# Altium project Sub Board Bottom.PrjPcb
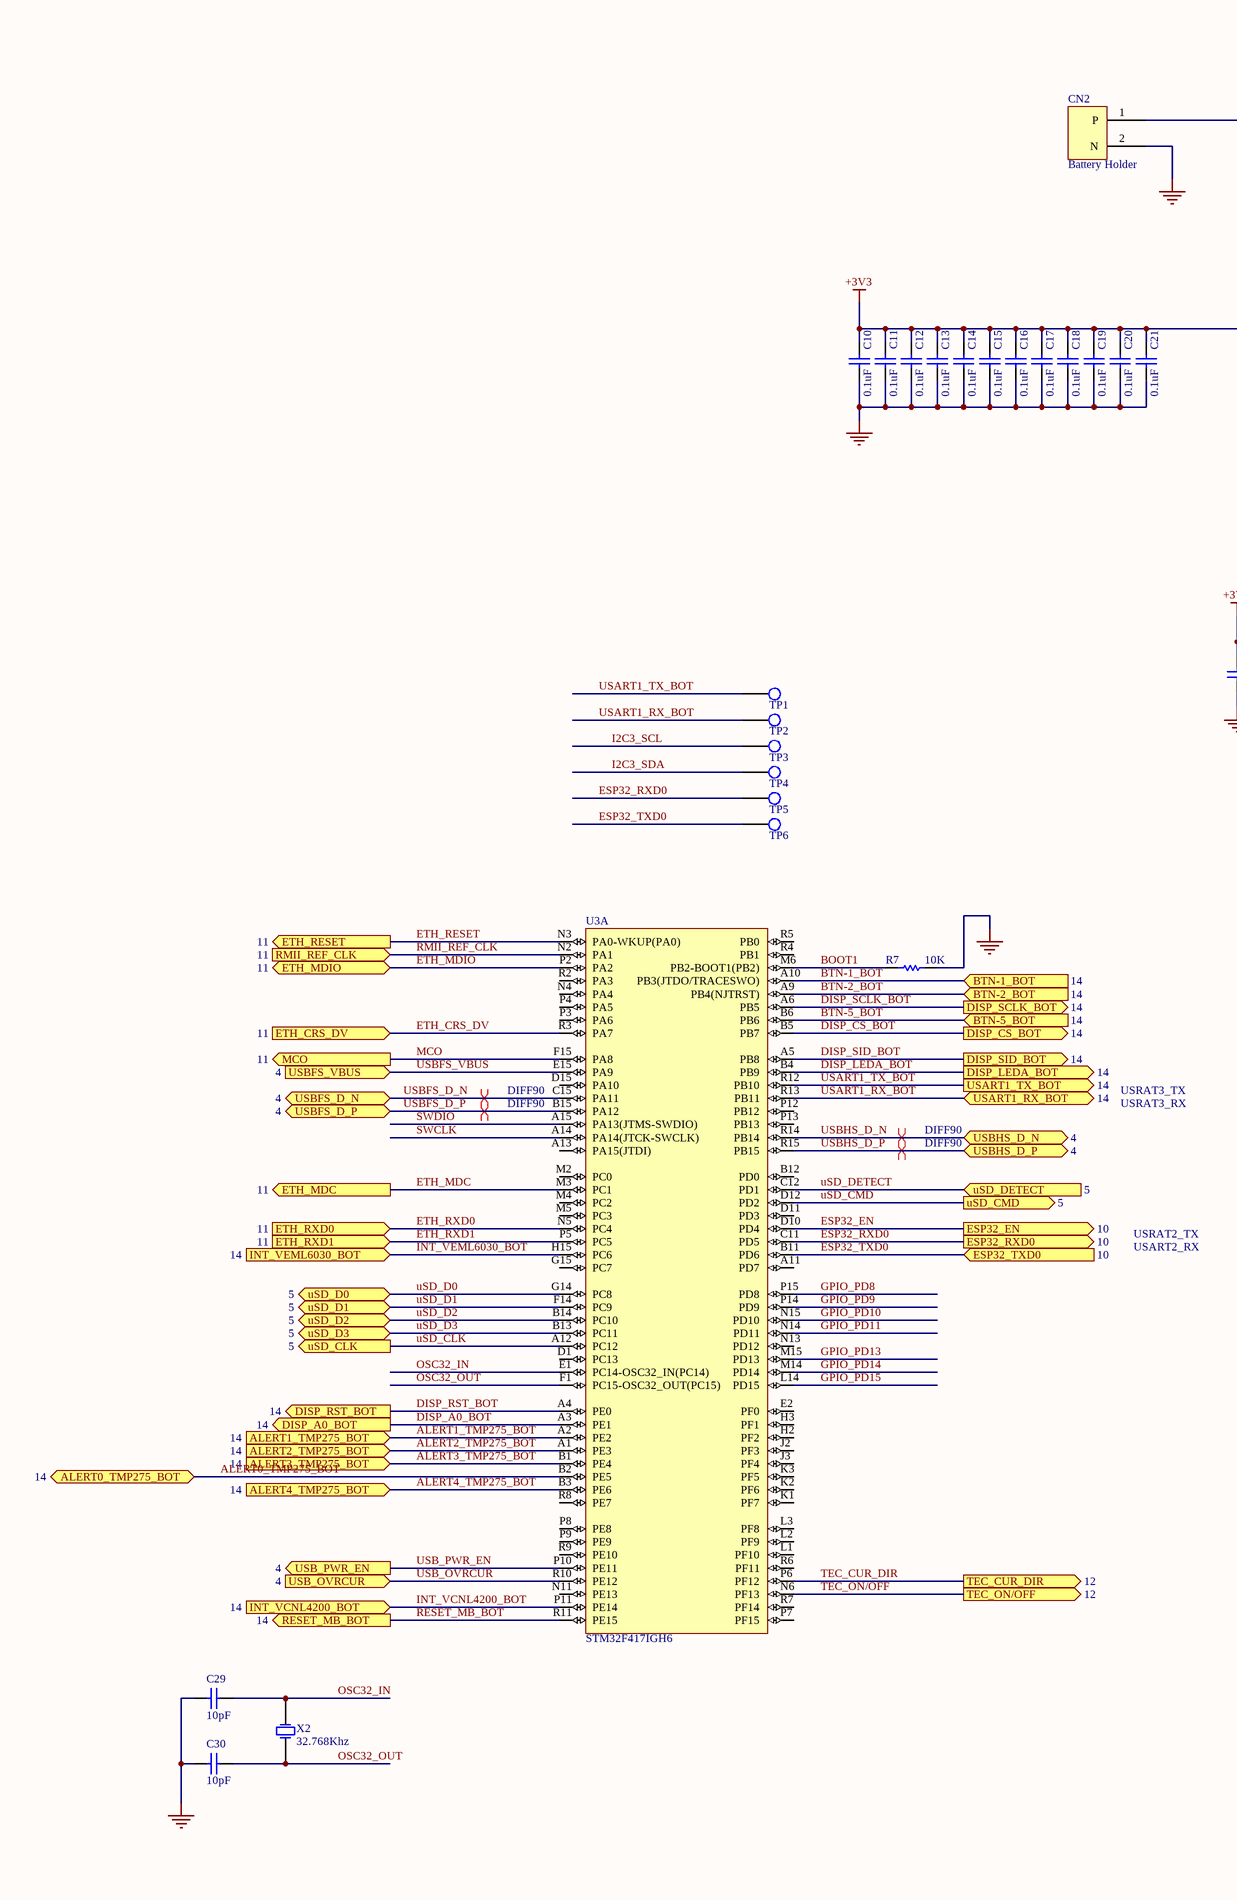
[diagram p0: [02] - MCU.SchDoc, left]
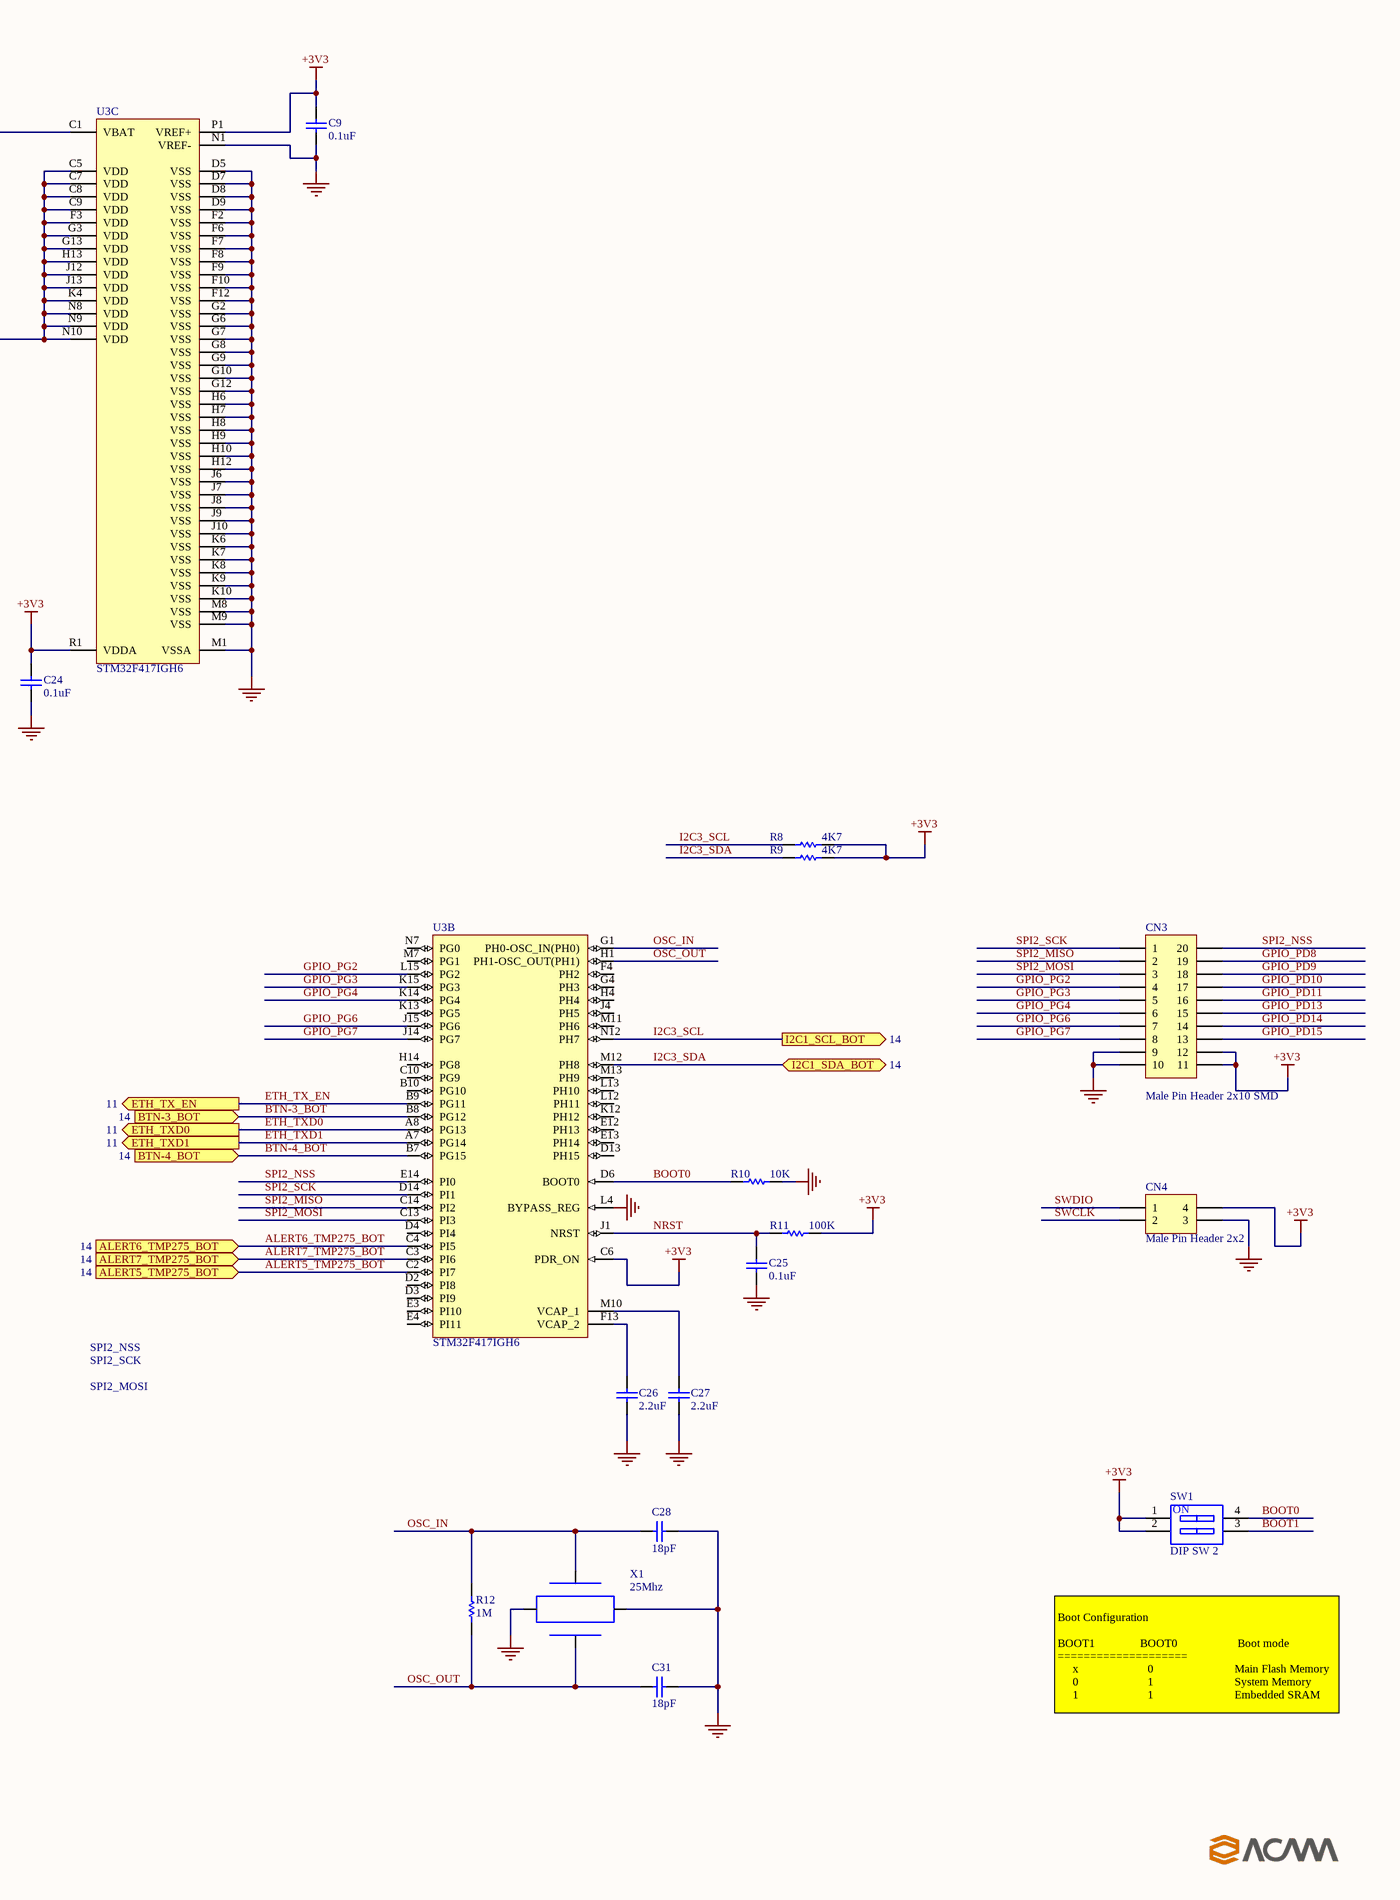
[diagram p1: [02] - MCU.SchDoc, right]
7 sheets, 134 parts. Net scope: flat (ports and power ports of the same name join across sheets).
Board files: Bottom Board_PCB.PcbDoc, Bottom Board_Panel.PcbDoc
Sheets:
  [02] - MCU.SchDoc
  [04] - USB INTERFACE.SchDoc
  [05] - MicroSD.SchDoc
  [10] - ESP32.SchDoc
  [11] - LAN.SchDoc
  [12] - RELAYS.SchDoc
  [14] - BOT BOARD HEADER.SchDoc

## Sheet [02] - MCU.SchDoc
size A2; DocumentNumber: 2; SheetNumber: 2; SheetTotal: 14

### Parts
C9  0.1uF  [0402_C_AUTO]
C10  0.1uF  [0402_C_AUTO]
C11  0.1uF  [0402_C_AUTO]
C12  0.1uF  [0402_C_AUTO]
C13  0.1uF  [0402_C_AUTO]
C14  0.1uF  [0402_C_AUTO]
C15  0.1uF  [0402_C_AUTO]
C16  0.1uF  [0402_C_AUTO]
C17  0.1uF  [0402_C_AUTO]
C18  0.1uF  [0402_C_AUTO]
C19  0.1uF  [0402_C_AUTO]
C20  0.1uF  [0402_C_AUTO]
C21  0.1uF  [0402_C_AUTO]
C24  0.1uF  [0402_C_AUTO]
C25  0.1uF  [0402_C_AUTO]
C26  2.2uF  [0402_C_AUTO]
C27  2.2uF  [0402_C_AUTO]
C28  18pF  [0402_C_AUTO]
C29  10pF  [0402_C_AUTO]
C30  10pF  [0402_C_AUTO]
C31  18pF  [0402_C_AUTO]
CN2  Battery Holder  [CR2032_BATT_HOLDER]
CN3  Male Pin Header 2x10 SMD  [HEADER_SMD_2x10]
CN4  Male Pin Header 2x2  [Header_2x2_RIGHT]
R7  10K  [0402_R_AUTO]
R8  4K7  [0402_R]
R9  4K7  [0402_R]
R10  10K  [0402_R_AUTO]
R11  100K  [0402_R_AUTO]
R12  1M  [0402_R]
SW1  DIP SW 2  [DIP-SW-2-Piano]
TP1  Test Point  [PIN_1.5mm]  (value not drawn)
TP2  Test Point  [PIN_1.5mm]  (value not drawn)
TP3  Test Point  [PIN_1.5mm]  (value not drawn)
TP4  Test Point  [PIN_1.5mm]  (value not drawn)
TP5  Test Point  [PIN_1mm]  (value not drawn)
TP6  Test Point  [PIN_1mm]  (value not drawn)
U3  STM32F417IGH6  [STM-UFBGA176+25]  (parts A,B,C of 3)
X1  25Mhz  [OSC_3.2x2.5]
X2  32.768Khz  [XTAL_2.0x1.2]

### Ports
ALERT0_TMP275_BOT (bidir, see 14), ALERT1_TMP275_BOT (in, see 14), ALERT2_TMP275_BOT (in, see 14), ALERT3_TMP275_BOT (in, see 14), ALERT4_TMP275_BOT (in, see 14), ALERT5_TMP275_BOT (in, see 14), ALERT6_TMP275_BOT (in, see 14), ALERT7_TMP275_BOT (in, see 14), BTN-1_BOT (in, see 14), BTN-2_BOT (in, see 14), BTN-3_BOT (in, see 14), BTN-4_BOT (in, see 14), BTN-5_BOT (in, see 14), DISP_A0_BOT (out, see 14), DISP_CS_BOT (out, see 14), DISP_LEDA_BOT (out, see 14), DISP_RST_BOT (out, see 14), DISP_SCLK_BOT (out, see 14), DISP_SID_BOT (out, see 14), ESP32_EN (out, see 10), ESP32_RXD0 (out, see 10), ESP32_TXD0 (in, see 10), ETH_CRS_DV (in, see 11), ETH_MDC (out, see 11), ETH_MDIO (bidir, see 11), ETH_RESET (out, see 11), ETH_RXD0 (in, see 11), ETH_RXD1 (in, see 11), ETH_TX_EN (out, see 11), ETH_TXD0 (out, see 11), ETH_TXD1 (out, see 11), I2C1_SCL_BOT (out, see 14), I2C1_SDA_BOT (bidir, see 14), INT_VCNL4200_BOT (in, see 14), INT_VEML6030_BOT (in, see 14), MCO (out, see 11), RESET_MB_BOT (out, see 14), RMII_REF_CLK (in, see 11), TEC_CUR_DIR (out, see 12), TEC_ON/OFF (out, see 12), USART1_RX_BOT (bidir, see 14), USART1_TX_BOT (out, see 14), USB_OVRCUR (in, see 4), USB_PWR_EN (out, see 4), USBFS_D_N (bidir, see 4), USBFS_D_P (bidir, see 4), USBFS_VBUS (in, see 4), USBHS_D_N (bidir, see 4), USBHS_D_P (bidir, see 4), uSD_CLK (out, see 5), uSD_CMD (out, see 5), uSD_D0 (bidir, see 5), uSD_D1 (bidir, see 5), uSD_D2 (bidir, see 5), uSD_D3 (bidir, see 5), uSD_DETECT (in, see 5)

### Nets
+3V3: C9.2 C10.2 C11.2 C12.2 C13.2 C14.2 C15.2 C16.2 C17.2 C18.2 C19.2 C20.2 C21.2 C24.2 CN3.11 CN3.12 CN4.4 R8.1 R9.1 R11.2 SW1.1(A1) SW1.2(A2) U3.C5(VDD) U3.C6(PDR_ON) U3.C7(VDD) U3.C8(VDD) U3.C9(VDD) U3.F3(VDD) U3.G3(VDD) U3.G13(VDD) U3.H13(VDD) U3.J12(VDD) U3.J13(VDD) U3.K4(VDD) U3.N8(VDD) U3.N9(VDD) U3.N10(VDD) U3.P1(VREF+) U3.R1(VDDA)
GND: C9.1 C10.1 C11.1 C12.1 C13.1 C14.1 C15.1 C16.1 C17.1 C18.1 C19.1 C20.1 C21.1 C24.1 C25.1 C26.1 C27.1 C28.2 C29.1 C30.1 C31.2 CN2.2(N) CN3.9 CN3.10 CN4.3 R7.2 R10.2 U3.D5(VSS) U3.D7(VSS) U3.D8(VSS) U3.D9(VSS) U3.F2(VSS) U3.F6(VSS) U3.F7(VSS) U3.F8(VSS) U3.F9(VSS) U3.F10(VSS) U3.F12(VSS) U3.G2(VSS) U3.G6(VSS) U3.G7(VSS) U3.G8(VSS) U3.G9(VSS) U3.G10(VSS) U3.G12(VSS) U3.H6(VSS) U3.H7(VSS) U3.H8(VSS) U3.H9(VSS) U3.H10(VSS) U3.H12(VSS) U3.J6(VSS) U3.J7(VSS) U3.J8(VSS) U3.J9(VSS) U3.J10(VSS) U3.K6(VSS) U3.K7(VSS) U3.K8(VSS) U3.K9(VSS) U3.K10(VSS) U3.L4(BYPASS_REG) U3.M1(VSSA) U3.M8(VSS) U3.M9(VSS) U3.N1(VREF-) X1.2(GND1) X1.4(GND2)
ALERT0_TMP275_BOT: U3.B2(PE5) ; port ALERT0_TMP275_BOT
ALERT1_TMP275_BOT: U3.A2(PE2) ; port ALERT1_TMP275_BOT
ALERT2_TMP275_BOT: U3.A1(PE3) ; port ALERT2_TMP275_BOT
ALERT3_TMP275_BOT: U3.B1(PE4) ; port ALERT3_TMP275_BOT
ALERT4_TMP275_BOT: U3.B3(PE6) ; port ALERT4_TMP275_BOT
ALERT5_TMP275_BOT: U3.C2(PI7) ; port ALERT5_TMP275_BOT
ALERT6_TMP275_BOT: U3.C4(PI5) ; port ALERT6_TMP275_BOT
ALERT7_TMP275_BOT: U3.C3(PI6) ; port ALERT7_TMP275_BOT
BOOT0: R10.1 SW1.4(A4) U3.D6(BOOT0)
BOOT1: R7.1 SW1.3(A3) U3.M6(PB2-BOOT1(PB2))
BTN-1_BOT: U3.A10(PB3(JTDO/TRACESWO)) ; port BTN-1_BOT
BTN-2_BOT: U3.A9(PB4(NJTRST)) ; port BTN-2_BOT
BTN-3_BOT: U3.B8(PG12) ; port BTN-3_BOT
BTN-4_BOT: U3.B7(PG15) ; port BTN-4_BOT
BTN-5_BOT: U3.B6(PB6) ; port BTN-5_BOT
DISP_A0_BOT: U3.A3(PE1) ; port DISP_A0_BOT
DISP_CS_BOT: U3.B5(PB7) ; port DISP_CS_BOT
DISP_LEDA_BOT: U3.B4(PB9) ; port DISP_LEDA_BOT
DISP_RST_BOT: U3.A4(PE0) ; port DISP_RST_BOT
DISP_SCLK_BOT: U3.A6(PB5) ; port DISP_SCLK_BOT
DISP_SID_BOT: U3.A5(PB8) ; port DISP_SID_BOT
ESP32_EN: U3.D10(PD4) ; port ESP32_EN
ESP32_RXD0: TP5.1 U3.C11(PD5) ; port ESP32_RXD0
ESP32_TXD0: TP6.1 U3.B11(PD6) ; port ESP32_TXD0
ETH_CRS_DV: U3.R3(PA7) ; port ETH_CRS_DV
ETH_MDC: U3.M3(PC1) ; port ETH_MDC
ETH_MDIO: U3.P2(PA2) ; port ETH_MDIO
ETH_RESET: U3.N3(PA0-WKUP(PA0)) ; port ETH_RESET
ETH_RXD0: U3.N5(PC4) ; port ETH_RXD0
ETH_RXD1: U3.P5(PC5) ; port ETH_RXD1
ETH_TX_EN: U3.B9(PG11) ; port ETH_TX_EN
ETH_TXD0: U3.A8(PG13) ; port ETH_TXD0
ETH_TXD1: U3.A7(PG14) ; port ETH_TXD1
GPIO_PD8: CN3.19 U3.P15(PD8)
GPIO_PD9: CN3.18 U3.P14(PD9)
GPIO_PD10: CN3.17 U3.N15(PD10)
GPIO_PD11: CN3.16 U3.N14(PD11)
GPIO_PD13: CN3.15 U3.M15(PD13)
GPIO_PD14: CN3.14 U3.M14(PD14)
GPIO_PD15: CN3.13 U3.L14(PD15)
GPIO_PG2: CN3.4 U3.L15(PG2)
GPIO_PG3: CN3.5 U3.K15(PG3)
GPIO_PG4: CN3.6 U3.K14(PG4)
GPIO_PG6: CN3.7 U3.J15(PG6)
GPIO_PG7: CN3.8 U3.J14(PG7)
I2C3_SCL: R8.2 TP3.1 U3.N12(PH7) ; port I2C1_SCL_BOT
I2C3_SDA: R9.2 TP4.1 U3.M12(PH8) ; port I2C1_SDA_BOT
INT_VCNL4200_BOT: U3.P11(PE14) ; port INT_VCNL4200_BOT
INT_VEML6030_BOT: U3.H15(PC6) ; port INT_VEML6030_BOT
MCO: U3.F15(PA8) ; port MCO
NRST: C25.2 R11.1 U3.J1(NRST)
OSC32_IN: C29.2 U3.E1(PC14-OSC32_IN(PC14)) X2.1(OSC1)
OSC32_OUT: C30.2 U3.F1(PC15-OSC32_OUT(PC15)) X2.2(OSC2)
OSC_IN: C28.1 R12.2 U3.G1(PH0-OSC_IN(PH0)) X1.1
OSC_OUT: C31.1 R12.1 U3.H1(PH1-OSC_OUT(PH1)) X1.3
RESET_MB_BOT: U3.R11(PE15) ; port RESET_MB_BOT
RMII_REF_CLK: U3.N2(PA1) ; port RMII_REF_CLK
SPI2_MISO: CN3.2 U3.C14(PI2)
SPI2_MOSI: CN3.3 U3.C13(PI3)
SPI2_NSS: CN3.20 U3.E14(PI0)
SPI2_SCK: CN3.1 U3.D14(PI1)
SWCLK: CN4.2 U3.A14(PA14(JTCK-SWCLK))
SWDIO: CN4.1 U3.A15(PA13(JTMS-SWDIO))
TEC_CUR_DIR: U3.P6(PF12) ; port TEC_CUR_DIR
TEC_ON/OFF: U3.N6(PF13) ; port TEC_ON/OFF
USART1_RX_BOT: TP2.1 U3.R13(PB11) ; port USART1_RX_BOT
USART1_TX_BOT: TP1.1 U3.R12(PB10) ; port USART1_TX_BOT
USB_OVRCUR: U3.R10(PE12) ; port USB_OVRCUR
USB_PWR_EN: U3.P10(PE11) ; port USB_PWR_EN
USBFS_D_N: U3.C15(PA11) ; port USBFS_D_N
USBFS_D_P: U3.B15(PA12) ; port USBFS_D_P
USBFS_VBUS: U3.E15(PA9) ; port USBFS_VBUS
USBHS_D_N: U3.R14(PB14) ; port USBHS_D_N
USBHS_D_P: U3.R15(PB15) ; port USBHS_D_P
uSD_CLK: U3.A12(PC12) ; port uSD_CLK
uSD_CMD: U3.D12(PD2) ; port uSD_CMD
uSD_D0: U3.G14(PC8) ; port uSD_D0
uSD_D1: U3.F14(PC9) ; port uSD_D1
uSD_D2: U3.B14(PC10) ; port uSD_D2
uSD_D3: U3.B13(PC11) ; port uSD_D3
uSD_DETECT: U3.C12(PD1) ; port uSD_DETECT
NetC26_2: C26.2 U3.F13(VCAP_2)
NetC27_2: C27.2 U3.M10(VCAP_1)
NetCN2_1: CN2.1(P) U3.C1(VBAT)

Not connected (* = marked no-connect by the designer): U3 A11(PD7) A13(PA15(JTDI)) B10(PG10) B12(PD0) C10(PG9) D1(PC13) D2(PI8) D3(PI9) D4(PI4) D11(PD3) D13(PH15) D15(PA10) E2(PF0) E3(PI10) E4(PI11) E12(PH13) E13(PH14) F4(PH2) G4(PH3) G15(PC7) H2(PF2) H3(PF1) H4(PH4) H14(PG8) J2(PF3) J3(PF4) J4(PH5) K1(PF7) K2(PF6) K3(PF5) K12(PH12) K13(PG5) L1(PF10) L2(PF9) L3(PF8) L12(PH11) L13(PH10) M2(PC0) M4(PC2) M5(PC3) M7(PG1) M11(PH6) M13(PH9) N4(PA4) N7(PG0) N11(PE13) N13(PD12) P3(PA6) P4(PA5) P7(PF15) P8(PE8) P9(PE9) P12(PB12) P13(PB13) R2(PA3) R4(PB1) R5(PB0) R6(PF11) R7(PF14) R8(PE7) R9(PE10)

### Layout directives
differential pair; differential pair class DIFF90: USBFS_D_N, USBFS_D_P, USBHS_D_N, USBHS_D_P

### Notes on the sheet
- USRAT3_TX
- USRAT3_RX
- USRAT2_TX
- USART2_RX
- SPI2_NSS
- SPI2_SCK
- SPI2_MOSI
- Boot Configuration
  BOOT1               BOOT0                    Boot mode
  ====================
  x                       0                           Main Flash Memory
  0                       1                           System Memory
  1                       1                           Embedded SRAM
- (in symbol DIP SW-2) ON

### Library data of the parts
C9-C21 C24-C31 = Cap SMD: Non-Pol SMD Capacitor; RATED_VOLTAGE: 16V; Manufacturer Part Num: *
  C9-C21 C24 C25: Value: 0.1uF
  C26 C27: Value: 2.2uF
  C28 C31: Value: 18pF
  C29 C30: Value: 10pF
CN2 = Battery Holder: CR2032 Battery Holder SMD; Value: Battery Holder; Manufacturer Part Num: *
CN3 = Pin header Male 2x10 smd: SMD Male Pin Header 2.54mm Pitch, 2x10; Value: Male Pin Header 2x10 SMD
CN4 = Pin header Male 2x2: Male Pin Header 2.54mm Pitch, 2x2; Value: Male Pin Header 2x2
R7-R12 = Res SMD: SMD Resistor; Tolerance: 5%; Manufacturer Part Num: *
  R7 R10: Value: 10K
  R8 R9: Value: 4K7
  R11: Value: 100K
  R12: Value: 1M
SW1 = DIP SW-2: DIP Switch, 2 Position, SPST; Manufacturer Part Num: BPA02B; Value: DIP SW 2
TP1-TP6 = Test Point: Test Point Footprint; Value: Test Point
U3 = STM32F417IGH6: ARM Cortex-M4 32-bit MCU+FPU, 210 DMIPS, 1024 kB Flash, 192 kB Internal RAM, 140 I/Os, 176-pin BGA, -40 to 85 degC, Tray; Manufacturer: STMicroelectronics; D/A Converter: 2x12-bit; FLASH Size (Prog) (kB): 1024; I/Os (High Current): 140; Internal RAM Size (kB): 192; Operating Frequency(F) (Processor speed) (MHz): 168; Supply Voltage(Vcc) max (V): 3.6; Supply Voltage(Vcc) min (V): 1.8; DatasheetVersion: Rev. 4; PackageVersion: Rev. 4, 06/2013; PackageReference: UFBGA176+25; PackageDescription: 176+25-Ball Ultra Thin Fine Pitch Ball Grid Array, 10 x 10 x 0.6 mm Body, 0.65 mm Pitch; Supplier 1: Digi-Key; Supplier Part Number 1: 497-11913-ND; Supplier 2: Farnell; Supplier Part Number 2: 2064371; Supplier 3: Newark; Supplier Part Number 3: 73T2336; Supplier 4: Mouser; Supplier Part Number 4: 511-STM32F417IGH6; Core: ARM Cortex-M4; Packing: Tray; Mounting Technology: Surface Mount; PartNumber: STM32F417IGH6; ComponentLink1Description: Manufacturer URL; ComponentLink1URL: http://www.st.com/web/en/home.html; ComponentLink2Description: Datasheet; ComponentLink2URL: http://www.st.com/st-web-ui/static/active/en/resource/technical/document/datasheet/DM00035129.pdf; ComponentLink3Description: Package Specification; ComponentLink3URL: http://www.st.com/st-web-ui/static/active/en/resource/technical/document/datasheet/DM00037051.pdf
X1 = XTAL 4pin: 4-pin SMD Crystal; Manufacturer Part Num: ECS-250-18-33-JTN-TR; Value: 25Mhz
X2 = XTAL: 2-pin SMD Crystal; Manufacturer Part Num: ECS-.327-12.5-12R-TR; Value: 32.768Khz

## Sheet [04] - USB INTERFACE.SchDoc
size A4; DocumentNumber: 4; SheetNumber: 4; SheetTotal: 14
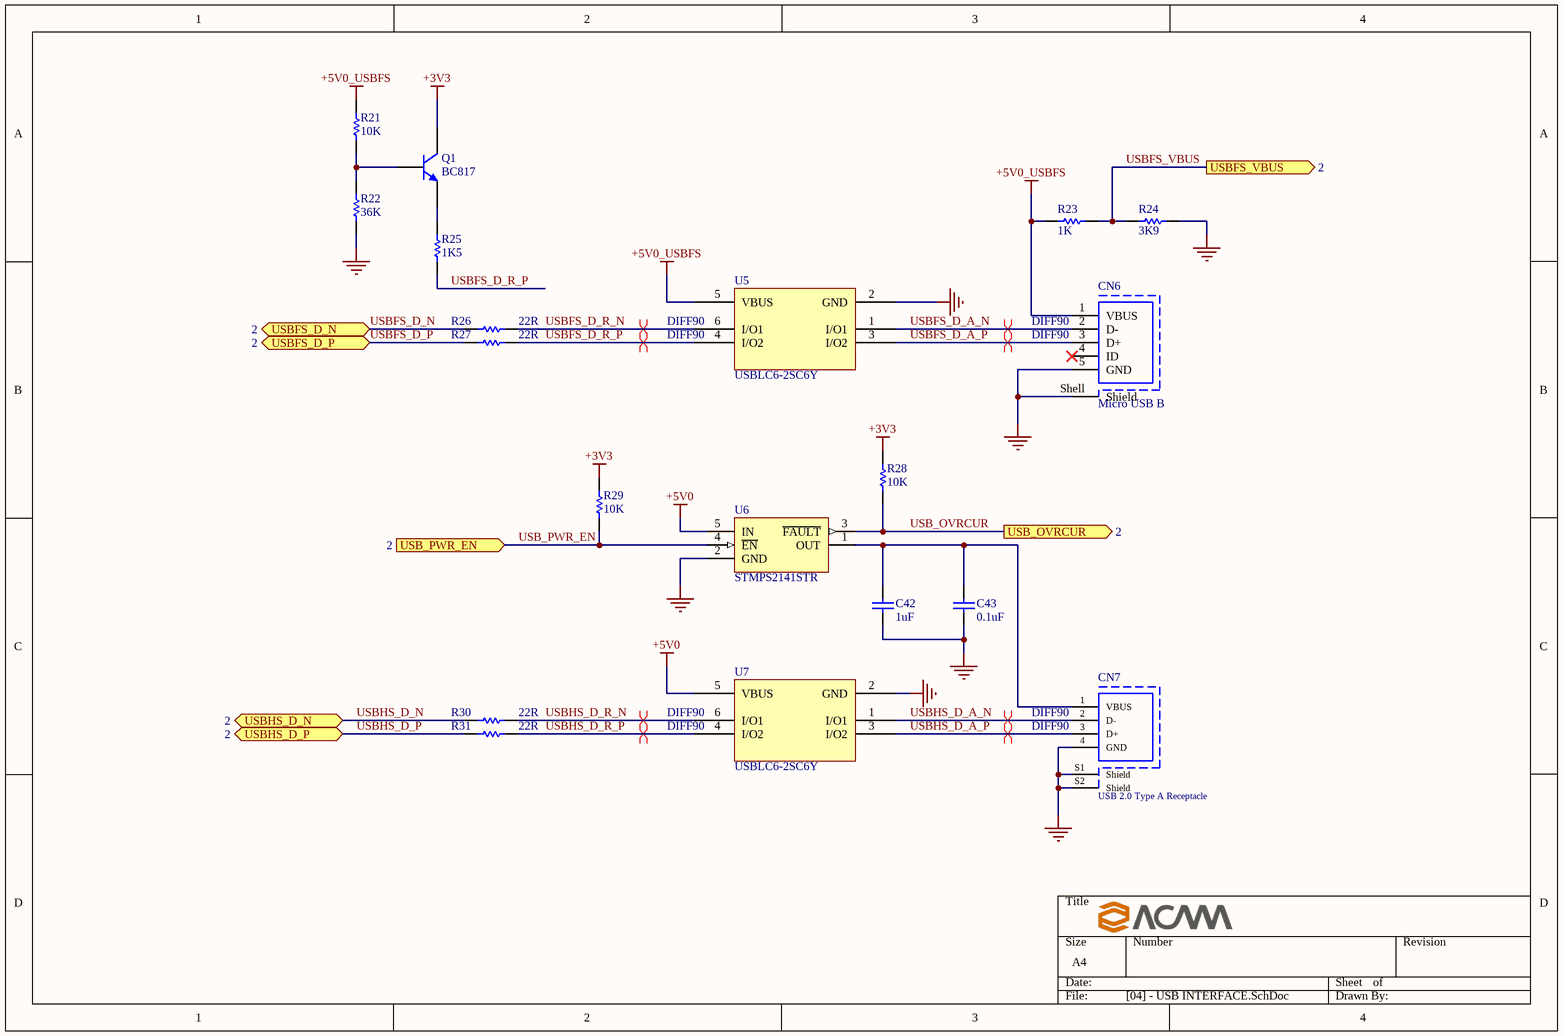
[diagram p2: [04] - USB INTERFACE.SchDoc]

### Parts
C42  1uF  [0805_C_AUTO]
C43  0.1uF  [0805_C_AUTO]
CN6  Micro USB B  [USB_Micro_B]
CN7  USB 2.0 Type A Receptacle  [USB_Type_A]
Q1  BC817  [SOT23]
R21  10K  [0402_R]
R22  36K  [0402_R]
R23  1K  [0402_R]
R24  3K9  [0402_R]
R25  1K5  [0402_R]
R26  22R  [0402_R]
R27  22R  [0402_R]
R28  10K  [0402_R]
R29  10K  [0402_R]
R30  22R  [0402_R]
R31  22R  [0402_R]
U5  USBLC6-2SC6Y  [SOT23-6L]
U6  STMPS2141STR  [SOT-23-5pin]
U7  USBLC6-2SC6Y  [SOT23-6L]

### Ports
USB_OVRCUR (out, see 2), USB_PWR_EN (in, see 2), USBFS_D_N (bidir, see 2), USBFS_D_P (bidir, see 2), USBFS_VBUS (out, see 2), USBHS_D_N (bidir, see 2), USBHS_D_P (bidir, see 2)

### Nets
+3V3: Q1.3(C) R28.1 R29.1
+5V0: U6.5(IN) U7.5(VBUS)
+5V0_USBFS: CN6.1(VBUS) R21.2 R23.2 U5.5(VBUS)
GND: C42.1 C43.1 CN6.5(GND) CN6.Shell(Shield) CN7.4(GND) CN7.S1(Shield) CN7.S2(Shield) R22.1 R24.1 U5.2(GND) U6.2(GND) U7.2(GND)
USB_OVRCUR: R28.2 U6.3(~{FAULT}) ; port USB_OVRCUR
USB_PWR_EN: R29.2 U6.4(~{EN}) ; port USB_PWR_EN
USBFS_D_A_N: CN6.2(D-) U5.1(I/O1)
USBFS_D_A_P: CN6.3(D+) U5.3(I/O2)
USBFS_D_N: R26.1 ; port USBFS_D_N
USBFS_D_P: R27.1 ; port USBFS_D_P
USBFS_D_R_N: R26.2 U5.6(I/O1)
USBFS_D_R_P: R25.1 R27.2 U5.4(I/O2)
USBFS_VBUS: R23.1 R24.2 ; port USBFS_VBUS
USBHS_D_A_N: CN7.2(D-) U7.1(I/O1)
USBHS_D_A_P: CN7.3(D+) U7.3(I/O2)
USBHS_D_N: R30.1 ; port USBHS_D_N
USBHS_D_P: R31.1 ; port USBHS_D_P
USBHS_D_R_N: R30.2 U7.6(I/O1)
USBHS_D_R_P: R31.2 U7.4(I/O2)
NetC42_2: C42.2 C43.2 CN7.1(VBUS) U6.1(OUT)
NetQ1_1: Q1.1(B) R21.1 R22.2
NetQ1_2: Q1.2(E) R25.2

Not connected (* = marked no-connect by the designer): CN6 4(ID)*

### Layout directives
differential pair; differential pair class DIFF90: USBFS_D_A_N, USBFS_D_A_P, USBFS_D_R_N, USBFS_D_R_P, USBHS_D_A_N, USBHS_D_A_P, USBHS_D_R_N, USBHS_D_R_P

### Library data of the parts
C42 C43 = Cap SMD: as C9 on sheet [02] - MCU; Manufacturer Part Num: *
  C42: Value: 1uF
  C43: Value: 0.1uF
CN6 = USB Micro B #1: Micro USB 2.0 Type B Receptacle; Value: Micro USB B
CN7 = USB Type A: USB 2.0 Type A, Receptacle, Horizontal, THT; Value: USB 2.0 Type A Receptacle
Q1 = Transistor NPN: NPN General Purpose Transistor; Value: BC817; Manufacturer Part Num: *
R21-R24 R26-R31 = Res SMD: SMD Resistor; Tolerance: 5%; Manufacturer Part Num: *
  R21 R28 R29: Value: 10K
  R22: Value: 36K
  R23: Value: 1K
  R24: Value: 3K9
  R26 R27 R30 R31: Value: 22R
R25 = Res SMD: SMD Resistor; Tolerance: 1%; Value: 1K5; Manufacturer Part Num: *
U5 U7 = USBLC6-2: Very low capacitance ESD protection; Value: USBLC6-2SC6Y
U6 = STMPS2141: Value: STMPS2141STR

## Sheet [05] - MicroSD.SchDoc
size A4; DocumentNumber: 5; SheetNumber: 5; SheetTotal: 14
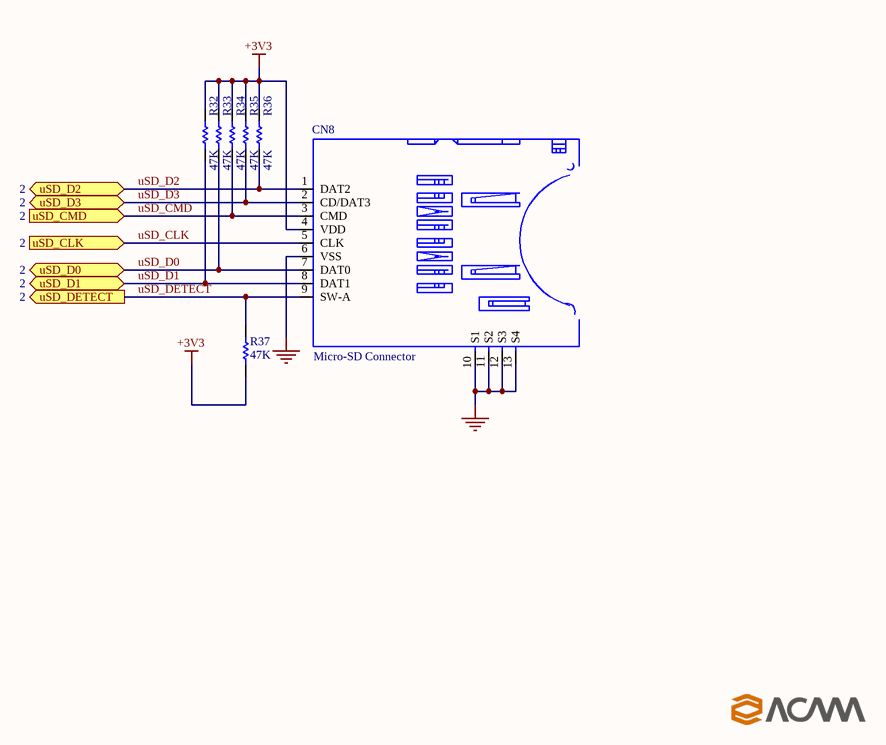
[diagram p3: [05] - MicroSD.SchDoc]

### Parts
CN8  Micro-SD Connector  [MICRO_SD_TFP-09-2-12B]
R32  47K  [0805_R]
R33  47K  [0805_R]
R34  47K  [0805_R]
R35  47K  [0805_R]
R36  47K  [0805_R]
R37  47K  [0805_R]

### Ports
uSD_CLK (in, see 2), uSD_CMD (in, see 2), uSD_D0 (bidir, see 2), uSD_D1 (bidir, see 2), uSD_D2 (bidir, see 2), uSD_D3 (bidir, see 2), uSD_DETECT (out, see 2)

### Nets
+3V3: CN8.4(VDD) R32.2 R33.2 R34.2 R35.2 R36.2 R37.1
GND: CN8.6(VSS) CN8.10(S1) CN8.11(S2) CN8.12(S3) CN8.13(S4)
uSD_CLK: CN8.5(CLK) ; port uSD_CLK
uSD_CMD: CN8.3(CMD) R34.1 ; port uSD_CMD
uSD_D0: CN8.7(DAT0) R33.1 ; port uSD_D0
uSD_D1: CN8.8(DAT1) R32.1 ; port uSD_D1
uSD_D2: CN8.1(DAT2) R36.1 ; port uSD_D2
uSD_D3: CN8.2(CD/DAT3) R35.1 ; port uSD_D3
uSD_DETECT: CN8.9(SW-A) R37.2 ; port uSD_DETECT

### Library data of the parts
CN8 = MicroSD_Connector #2: Javanelec 1.10mm Pitch microSD Memory Card Connector. Push-Push; Manufacturer Part Num: TFP-09-2-12B; Value: Micro-SD Connector
R32-R37 = Res SMD: SMD Resistor; Tolerance: 5%; Value: 47K; Manufacturer Part Num: *

## Sheet [10] - ESP32.SchDoc
size A4; DocumentNumber: 10; SheetNumber: 10; SheetTotal: 14
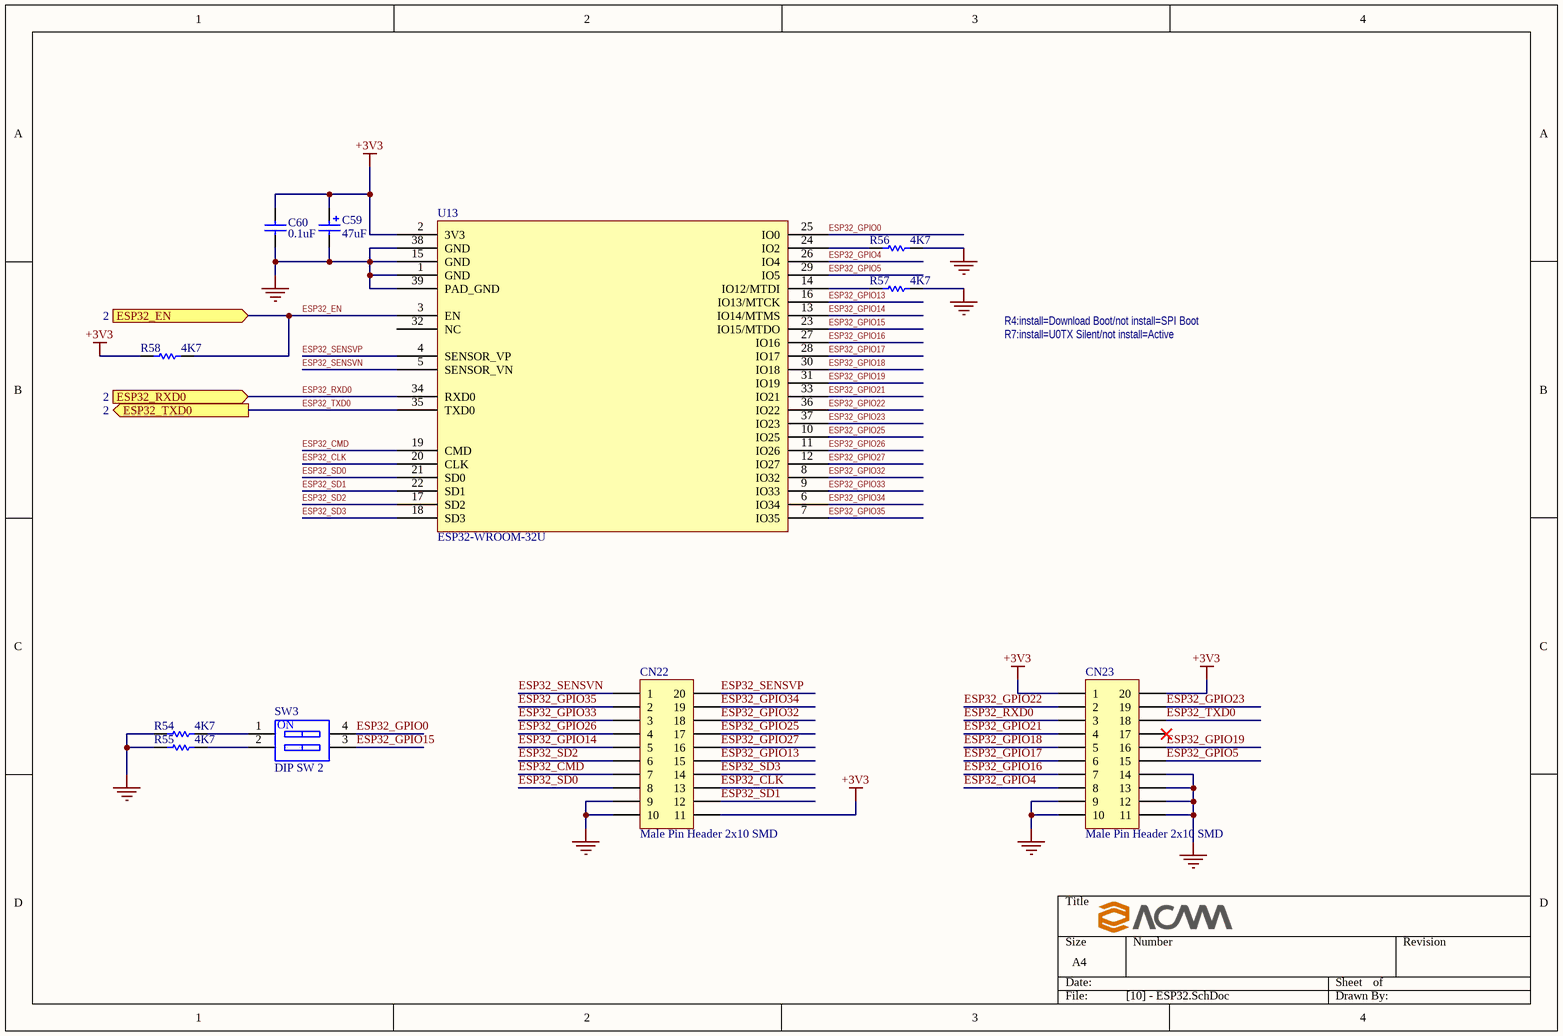
[diagram p4: [10] - ESP32.SchDoc]

### Parts
C59  47uF  [TANT_B]
C60  0.1uF  [0402_C]
CN22  Male Pin Header 2x10 SMD  [HEADER_SMD_2x10]
CN23  Male Pin Header 2x10 SMD  [HEADER_SMD_2x10]
R54  4K7  [0402_R]
R55  4K7  [0402_R]
R56  4K7  [0402_R]
R57  4K7  [0402_R]
R58  4K7  [0402_R]
SW3  DIP SW 2  [DIP-SW-2-Piano]
U13  ESP32-WROOM-32U  [ESP32S_W]

### Ports
ESP32_EN (in, see 2), ESP32_RXD0 (in, see 2), ESP32_TXD0 (out, see 2)

### Nets
+3V3: C59.1 C60.1 CN22.11 CN23.1 CN23.20 R58.1 U13.2(3V3)
GND: C59.2 C60.2 CN22.9 CN22.10 CN23.9 CN23.10 CN23.11 CN23.12 CN23.13 CN23.14 R54.1 R55.1 R56.2 R57.2 U13.1(GND) U13.15(GND) U13.38(GND) U13.39(PAD_GND)
ESP32_CLK: CN22.13 U13.20(CLK)
ESP32_CMD: CN22.7 U13.19(CMD)
ESP32_EN: R58.2 U13.3(EN) ; port ESP32_EN
ESP32_GPIO0: SW3.4(A4) U13.25(IO0)
ESP32_GPIO4: CN23.8 U13.26(IO4)
ESP32_GPIO5: CN23.15 U13.29(IO5)
ESP32_GPIO13: CN22.15 U13.16(IO13/MTCK)
ESP32_GPIO14: CN22.5 U13.13(IO14/MTMS)
ESP32_GPIO15: SW3.3(A3) U13.23(IO15/MTDO)
ESP32_GPIO16: CN23.7 U13.27(IO16)
ESP32_GPIO17: CN23.6 U13.28(IO17)
ESP32_GPIO18: CN23.5 U13.30(IO18)
ESP32_GPIO19: CN23.16 U13.31(IO19)
ESP32_GPIO21: CN23.4 U13.33(IO21)
ESP32_GPIO22: CN23.2 U13.36(IO22)
ESP32_GPIO23: CN23.19 U13.37(IO23)
ESP32_GPIO25: CN22.17 U13.10(IO25)
ESP32_GPIO26: CN22.4 U13.11(IO26)
ESP32_GPIO27: CN22.16 U13.12(IO27)
ESP32_GPIO32: CN22.18 U13.8(IO32)
ESP32_GPIO33: CN22.3 U13.9(IO33)
ESP32_GPIO34: CN22.19 U13.6(IO34)
ESP32_GPIO35: CN22.2 U13.7(IO35)
ESP32_RXD0: CN23.3 U13.34(RXD0) ; port ESP32_RXD0
ESP32_SD0: CN22.8 U13.21(SD0)
ESP32_SD1: CN22.12 U13.22(SD1)
ESP32_SD2: CN22.6 U13.17(SD2)
ESP32_SD3: CN22.14 U13.18(SD3)
ESP32_SENSVN: CN22.1 U13.5(SENSOR_VN)
ESP32_SENSVP: CN22.20 U13.4(SENSOR_VP)
ESP32_TXD0: CN23.18 U13.35(TXD0) ; port ESP32_TXD0
NetR54_2: R54.2 SW3.1(A1)
NetR55_2: R55.2 SW3.2(A2)
NetR56_1: R56.1 U13.24(IO2)
NetR57_1: R57.1 U13.14(IO12/MTDI)

Not connected (* = marked no-connect by the designer): CN23 17*; U13 32(NC)

### Notes on the sheet
- R7:install=U0TX Silent/not install=Active
- R4:install=Download Boot/not install=SPI Boot
- (in symbol DIP SW-2) ON

### Library data of the parts
C59 = Cap Tant: Tantalum Polarized Capacitor; RATED_VOLTAGE: 6.3V; Value: 47uF
C60 = Cap SMD: as C9 on sheet [02] - MCU; Value: 0.1uF; Manufacturer Part Num: *
CN22 CN23 = Pin header Male 2x10 smd: SMD Male Pin Header 2.54mm Pitch, 2x10; Value: Male Pin Header 2x10 SMD
R54-R58 = Res SMD: SMD Resistor; Tolerance: 1%; Value: 4K7; Manufacturer Part Num: *
SW3 = DIP SW-2: as SW1 on sheet [02] - MCU; Value: DIP SW 2
U13 = ESP32-WROOM-32U: powerful, generic Wi-Fi+BT+BLE MCU module; Value: ESP32-WROOM-32U

## Sheet [11] - LAN.SchDoc
size A3; DocumentNumber: 11; SheetNumber: 11; SheetTotal: 14
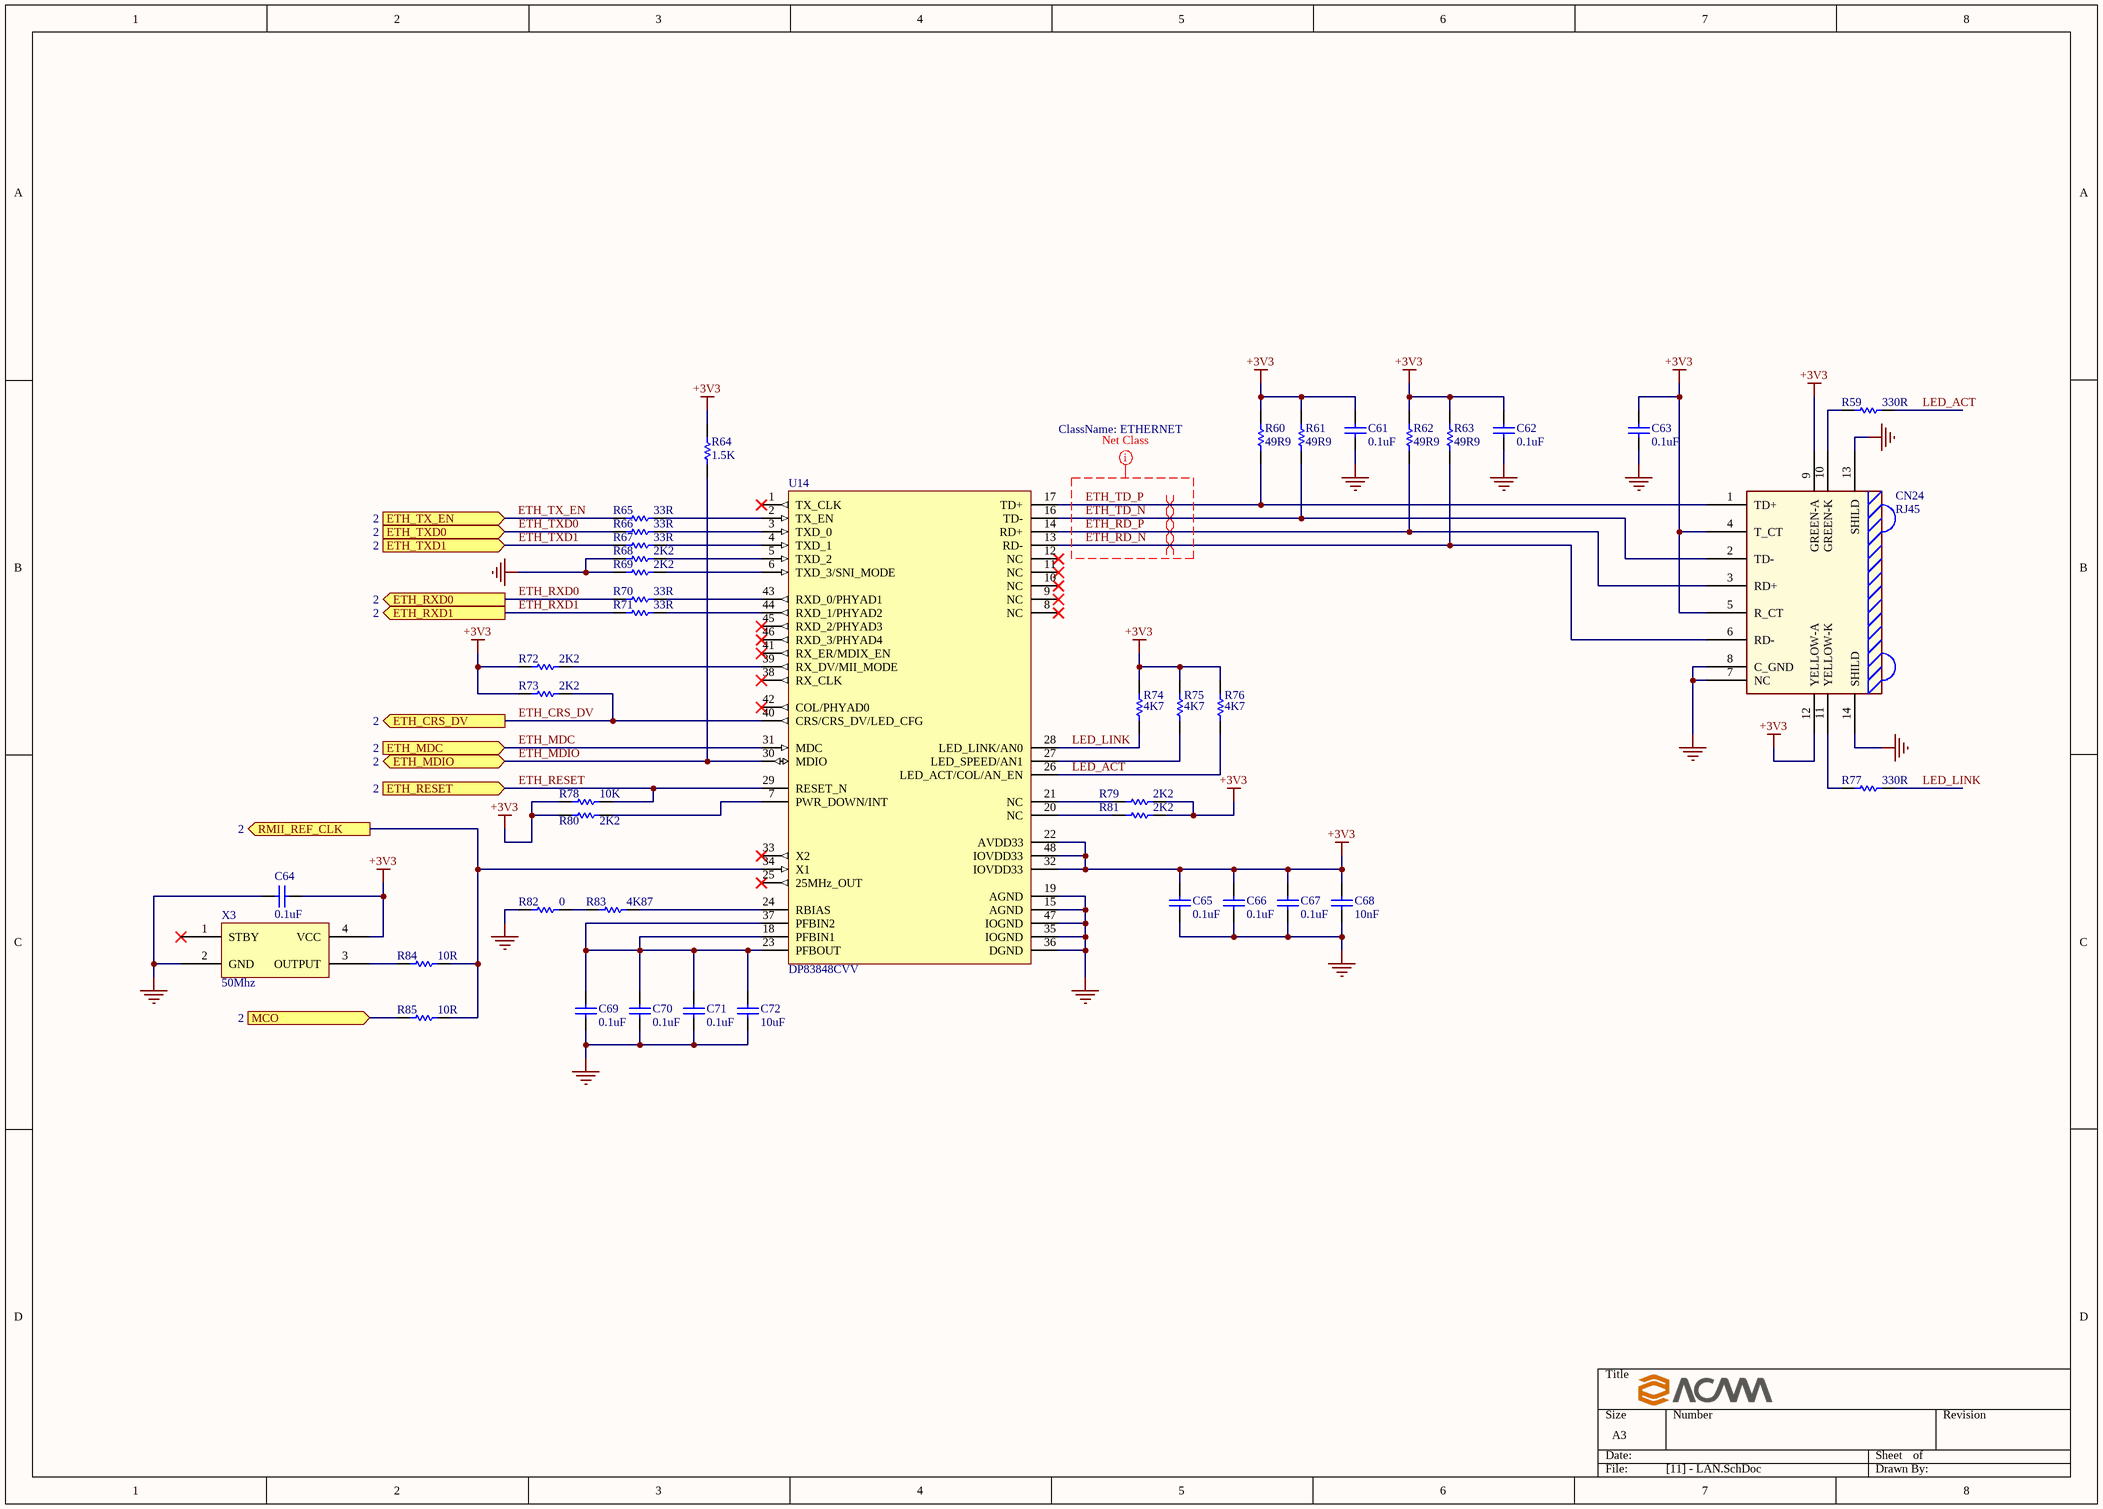
[diagram p5: [11] - LAN.SchDoc]

### Parts
C61  0.1uF  [0402_C]
C62  0.1uF  [0402_C]
C63  0.1uF  [0402_C]
C64  0.1uF  [0402_C]
C65  0.1uF  [0402_C]
C66  0.1uF  [0402_C]
C67  0.1uF  [0402_C]
C68  10nF  [0402_C]
C69  0.1uF  [0402_C]
C70  0.1uF  [0402_C]
C71  0.1uF  [0402_C]
C72  10uF  [0402_C]
CN24  RJ45  [HR911105A]
R59  330R  [0402_R]
R60  49R9  [0402_R]
R61  49R9  [0402_R]
R62  49R9  [0402_R]
R63  49R9  [0402_R]
R64  1.5K  [0402_R]
R65  33R  [0402_R]
R66  33R  [0402_R]
R67  33R  [0402_R]
R68  2K2  [0402_R]
R69  2K2  [0402_R]
R70  33R  [0402_R]
R71  33R  [0402_R]
R72  2K2  [0402_R]
R73  2K2  [0402_R]
R74  4K7  [0402_R]
R75  4K7  [0402_R]
R76  4K7  [0402_R]
R77  330R  [0402_R]
R78  10K  [0402_R]
R79  2K2  [0402_R]
R80  2K2  [0402_R]
R81  2K2  [0402_R]
R82  0  [0402_R]
R83  4K87  [0402_R]
R84  10R  [0402_R]
R85  10R  [0402_R]
U14  DP83848CVV  [TQFP48_M]
X3  50Mhz  [OSC_3.2x2.5]

### Ports
ETH_CRS_DV (out, see 2), ETH_MDC (in, see 2), ETH_MDIO (bidir, see 2), ETH_RESET (in, see 2), ETH_RXD0 (out, see 2), ETH_RXD1 (out, see 2), ETH_TX_EN (in, see 2), ETH_TXD0 (in, see 2), ETH_TXD1 (in, see 2), MCO (in, see 2), RMII_REF_CLK (out, see 2)

### Nets
+3V3: C61.2 C62.2 C63.2 C64.1 C65.1 C66.1 C67.1 C68.1 CN24.4(T_CT) CN24.5(R_CT) CN24.9(GREEN-A) CN24.12(YELLOW-A) R60.2 R61.2 R62.2 R63.2 R64.2 R72.1 R73.1 R74.2 R75.2 R76.2 R78.1 R79.2 R80.1 R81.2 U14.22(AVDD33) U14.32(IOVDD33) U14.48(IOVDD33) X3.4(VCC)
GND: C61.1 C62.1 C63.1 C64.2 C65.2 C66.2 C67.2 C68.2 C69.1 C70.1 C71.1 C72.1 CN24.7(NC) CN24.8(C_GND) CN24.13(SHILD) CN24.14(SHILD) R68.1 R69.1 R82.1 U14.15(AGND) U14.19(AGND) U14.35(IOGND) U14.36(DGND) U14.47(IOGND) X3.2(GND)
ETH_CRS_DV: R73.2 U14.40(CRS/CRS_DV/LED_CFG) ; port ETH_CRS_DV
ETH_MDC: U14.31(MDC) ; port ETH_MDC
ETH_MDIO: R64.1 U14.30(MDIO) ; port ETH_MDIO
ETH_RD_N: CN24.6(RD-) R63.1 U14.13(RD-)
ETH_RD_P: CN24.3(RD+) R62.1 U14.14(RD+)
ETH_RESET: R78.2 U14.29(RESET_N) ; port ETH_RESET
ETH_RXD0: R70.1 ; port ETH_RXD0
ETH_RXD1: R71.1 ; port ETH_RXD1
ETH_TD_N: CN24.2(TD-) R61.1 U14.16(TD-)
ETH_TD_P: CN24.1(TD+) R60.1 U14.17(TD+)
ETH_TX_EN: R65.1 ; port ETH_TX_EN
ETH_TXD0: R66.1 ; port ETH_TXD0
ETH_TXD1: R67.1 ; port ETH_TXD1
LED_ACT: R59.2 R76.1 U14.26(LED_ACT/COL/AN_EN)
LED_LINK: R74.1 R77.2 U14.28(LED_LINK/AN0)
MCO: R85.1 ; port MCO
RMII_REF_CLK: R84.2 R85.2 U14.34(X1) ; port RMII_REF_CLK
NetC69_2: C69.2 C70.2 C71.2 C72.2 U14.18(PFBIN1) U14.23(PFBOUT) U14.37(PFBIN2)
NetCN24_10: CN24.10(GREEN-K) R59.1
NetCN24_11: CN24.11(YELLOW-K) R77.1
NetR65_2: R65.2 U14.2(TX_EN)
NetR66_2: R66.2 U14.3(TXD_0)
NetR67_2: R67.2 U14.4(TXD_1)
NetR68_2: R68.2 U14.5(TXD_2)
NetR69_2: R69.2 U14.6(TXD_3/SNI_MODE)
NetR70_2: R70.2 U14.43(RXD_0/PHYAD1)
NetR71_2: R71.2 U14.44(RXD_1/PHYAD2)
NetR72_2: R72.2 U14.39(RX_DV/MII_MODE)
NetR75_1: R75.1 U14.27(LED_SPEED/AN1)
NetR79_1: R79.1 U14.21(NC)
NetR80_2: R80.2 U14.7(PWR_DOWN/INT)
NetR81_1: R81.1 U14.20(NC)
NetR82_2: R82.2 R83.1
NetR83_2: R83.2 U14.24(RBIAS)
NetR84_1: R84.1 X3.3(OUTPUT)

Not connected (* = marked no-connect by the designer): U14 1(TX_CLK)* 8(NC)* 9(NC)* 10(NC)* 11(NC)* 12(NC)* 25(25MHz_OUT)* 33(X2)* 38(RX_CLK)* 41(RX_ER/MDIX_EN)* 42(COL/PHYAD0)* 45(RXD_2/PHYAD3)* 46(RXD_3/PHYAD4)*; X3 1(STBY)*

### Layout directives
net class ETHERNET: ETH_RD_N, ETH_RD_P, ETH_TD_N, ETH_TD_P
differential pair; differential pair class DIFF100: ETH_RD_N, ETH_RD_P, ETH_TD_N, ETH_TD_P

### Library data of the parts
C61-C72 = Cap SMD: as C9 on sheet [02] - MCU; Manufacturer Part Num: *
  C61-C67 C69-C71: Value: 0.1uF
  C68: Value: 10nF
  C72: Value: 10uF
CN24 = RJ45 Connector #1: RJ45 Socket with Magnet and LED; value: RJ45; Manufacturer Part Num: HR911105A
R59-R77 R79-R81 = Res SMD: SMD Resistor; Tolerance: 1%; Manufacturer Part Num: *
  R59 R77: Value: 330R
  R60-R63: Value: 49R9
  R64: Value: 1.5K
  R65-R67 R70 R71: Value: 33R
  R68 R69 R72 R73 R79-R81: Value: 2K2
  R74-R76: Value: 4K7
R78 R82 R84 R85 = Res SMD: SMD Resistor; Tolerance: 5%; Manufacturer Part Num: *
  R78: Value: 10K
  R82: Value: 0
  R84 R85: Value: 10R
R83 = Res SMD: SMD Resistor; Manufacturer Part Num: RC0402FR-074K87L; Tolerance: 1%; Value: 4K87
U14 = DP83848: 10/100 Mbps Ethernet PHY; Value: DP83848CVV
X3 = XTAL OSC: Crystal Oscillator; Manufacturer Part Num: ECS-3225S33-500-FN-TR; Value: 50Mhz

## Sheet [12] - RELAYS.SchDoc
size A4; DocumentNumber: 12; SheetNumber: 12; SheetTotal: 14
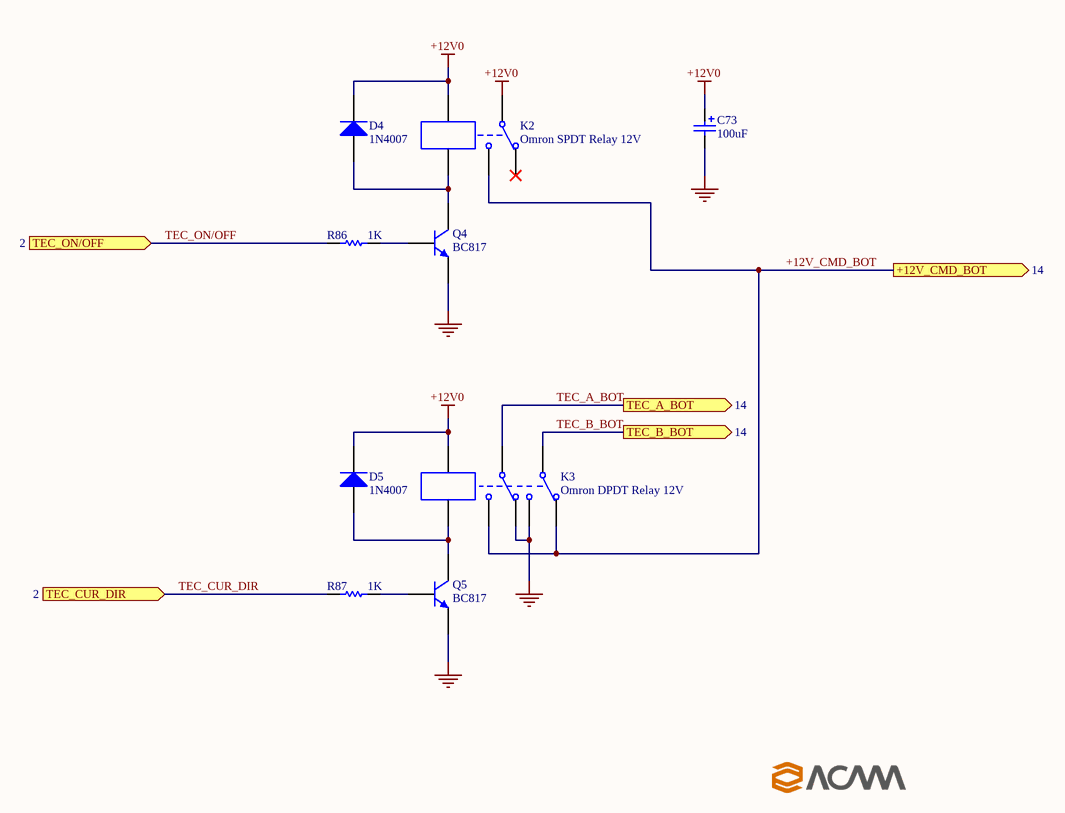
[diagram p6: [12] - RELAYS.SchDoc]

### Parts
C73  100uF  [WCAP-ASLI_6.3x5.5]
D4  1N4007  [SMA]
D5  1N4007  [SMA]
K2  Omron SPDT Relay 12V  [RELAY_SPDT]
K3  Omron DPDT Relay 12V  [RELAY_DPDT]
Q4  BC817  [SOT23]
Q5  BC817  [SOT23]
R86  1K  [0402_R]
R87  1K  [0402_R]

### Ports
+12V_CMD_BOT (out, see 14), TEC_A_BOT (out, see 14), TEC_B_BOT (out, see 14), TEC_CUR_DIR (in, see 2), TEC_ON/OFF (in, see 2)

### Nets
+12V0: C73.1 D4.2(K) D5.2(K) K2.1(Coil-A) K2.4(COM) K3.1(Coil-A)
GND: C73.2 K3.2(Pole_1_NC) K3.5(Pole_2_NO) Q4.2(E) Q5.2(E)
+12V_CMD_BOT: K2.3(NO) K3.4(Pole_1_NO) K3.7(Pole_2_NC) ; port +12V_CMD_BOT
TEC_A_BOT: K3.3(Pole_1_COM) ; port TEC_A_BOT
TEC_B_BOT: K3.6(Pole_2_COM) ; port TEC_B_BOT
TEC_CUR_DIR: R87.1 ; port TEC_CUR_DIR
TEC_ON/OFF: R86.1 ; port TEC_ON/OFF
NetD4_1: D4.1(A) K2.5(Coil-B) Q4.3(C)
NetD5_1: D5.1(A) K3.8(Coil-B) Q5.3(C)
NetQ4_1: Q4.1(B) R86.2
NetQ5_1: Q5.1(B) R87.2

Not connected (* = marked no-connect by the designer): K2 2(NC)*

### Library data of the parts
C73 = Cap Aluminium Electrolytic: Aluminium Electrolytic Capacitor; RATED_VOLTAGE: 16V; Value: 100uF; Manufacturer Part Num: *
D4 D5 = Diode: Value: 1N4007; Manufacturer Part Num: 1N4007
K2 = Relay-SPDT: Omron Single-Pole Dual-Throw Relay; Manufacturer Part Num: G2R-1-DC12; Value: Omron SPDT Relay 12V
K3 = Relay-DPDT: Omron Dual-Pole Dual-Throw Relay; Manufacturer Part Num: G2R-2-DC12; Value: Omron DPDT Relay 12V
Q4 Q5 = Transistor NPN: NPN General Purpose Transistor; Value: BC817; Manufacturer Part Num: *
R86 R87 = Res SMD: SMD Resistor; Tolerance: 5%; Value: 1K; Manufacturer Part Num: *

## Sheet [14] - BOT BOARD HEADER.SchDoc
size A4; DocumentNumber: 14; SheetNumber: 14; SheetTotal: 14
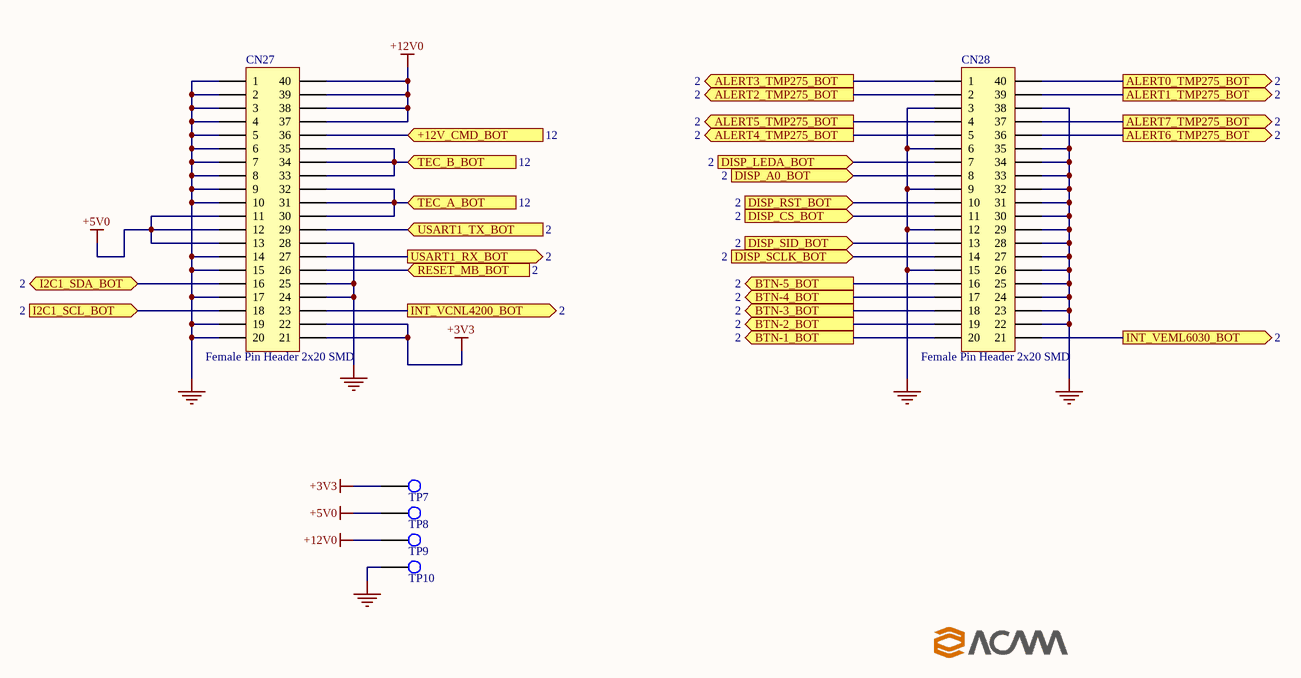
[diagram p7: [14] - BOT BOARD HEADER.SchDoc]

### Parts
CN27  Female Pin Header 2x20 SMD  [HEADER_FEMALE_SMD_2x20]
CN28  Female Pin Header 2x20 SMD  [HEADER_FEMALE_SMD_2x20]
TP7  Test Point  [PIN_2mm]  (value not drawn)
TP8  Test Point  [PIN_2mm]  (value not drawn)
TP9  Test Point  [PIN_2mm]  (value not drawn)
TP10  Test Point  [PIN_2mm]  (value not drawn)

### Ports
+12V_CMD_BOT (in, see 12), ALERT0_TMP275_BOT (out, see 2), ALERT1_TMP275_BOT (out, see 2), ALERT2_TMP275_BOT (out, see 2), ALERT3_TMP275_BOT (out, see 2), ALERT4_TMP275_BOT (out, see 2), ALERT5_TMP275_BOT (out, see 2), ALERT6_TMP275_BOT (out, see 2), ALERT7_TMP275_BOT (out, see 2), BTN-1_BOT (out, see 2), BTN-2_BOT (out, see 2), BTN-3_BOT (out, see 2), BTN-4_BOT (out, see 2), BTN-5_BOT (out, see 2), DISP_A0_BOT (in, see 2), DISP_CS_BOT (in, see 2), DISP_LEDA_BOT (in, see 2), DISP_RST_BOT (in, see 2), DISP_SCLK_BOT (in, see 2), DISP_SID_BOT (in, see 2), I2C1_SCL_BOT (in, see 2), I2C1_SDA_BOT (bidir, see 2), INT_VCNL4200_BOT (out, see 2), INT_VEML6030_BOT (out, see 2), RESET_MB_BOT (in, see 2), TEC_A_BOT (in, see 12), TEC_B_BOT (in, see 12), USART1_RX_BOT (out, see 2), USART1_TX_BOT (in, see 2)

### Nets
+3V3: CN27.21 CN27.22 TP7.1
+5V0: CN27.11 CN27.12 CN27.13 TP8.1
+12V0: CN27.37 CN27.38 CN27.39 CN27.40 TP9.1
GND: CN27.1 CN27.2 CN27.3 CN27.4 CN27.5 CN27.6 CN27.7 CN27.8 CN27.9 CN27.10 CN27.14 CN27.15 CN27.17 CN27.19 CN27.20 CN27.24 CN27.25 CN27.28 CN28.3 CN28.6 CN28.9 CN28.12 CN28.15 CN28.22 CN28.23 CN28.24 CN28.25 CN28.26 CN28.27 CN28.28 CN28.29 CN28.30 CN28.31 CN28.32 CN28.33 CN28.34 CN28.35 CN28.38 TP10.1
+12V_CMD_BOT: CN27.36 ; port +12V_CMD_BOT
ALERT0_TMP275_BOT: CN28.40 ; port ALERT0_TMP275_BOT
ALERT1_TMP275_BOT: CN28.39 ; port ALERT1_TMP275_BOT
ALERT2_TMP275_BOT: CN28.2 ; port ALERT2_TMP275_BOT
ALERT3_TMP275_BOT: CN28.1 ; port ALERT3_TMP275_BOT
ALERT4_TMP275_BOT: CN28.5 ; port ALERT4_TMP275_BOT
ALERT5_TMP275_BOT: CN28.4 ; port ALERT5_TMP275_BOT
ALERT6_TMP275_BOT: CN28.36 ; port ALERT6_TMP275_BOT
ALERT7_TMP275_BOT: CN28.37 ; port ALERT7_TMP275_BOT
BTN-1_BOT: CN28.20 ; port BTN-1_BOT
BTN-2_BOT: CN28.19 ; port BTN-2_BOT
BTN-3_BOT: CN28.18 ; port BTN-3_BOT
BTN-4_BOT: CN28.17 ; port BTN-4_BOT
BTN-5_BOT: CN28.16 ; port BTN-5_BOT
DISP_A0_BOT: CN28.8 ; port DISP_A0_BOT
DISP_CS_BOT: CN28.11 ; port DISP_CS_BOT
DISP_LEDA_BOT: CN28.7 ; port DISP_LEDA_BOT
DISP_RST_BOT: CN28.10 ; port DISP_RST_BOT
DISP_SCLK_BOT: CN28.14 ; port DISP_SCLK_BOT
DISP_SID_BOT: CN28.13 ; port DISP_SID_BOT
I2C3_SCL: CN27.18 ; port I2C1_SCL_BOT
I2C3_SDA: CN27.16 ; port I2C1_SDA_BOT
INT_VCNL4200_BOT: CN27.23 ; port INT_VCNL4200_BOT
INT_VEML6030_BOT: CN28.21 ; port INT_VEML6030_BOT
RESET_MB_BOT: CN27.26 ; port RESET_MB_BOT
TEC_A_BOT: CN27.30 CN27.31 CN27.32 ; port TEC_A_BOT
TEC_B_BOT: CN27.33 CN27.34 CN27.35 ; port TEC_B_BOT
USART1_RX_BOT: CN27.27 ; port USART1_RX_BOT
USART1_TX_BOT: CN27.29 ; port USART1_TX_BOT

### Library data of the parts
CN27 CN28 = Pin header Female 2x20 smd: SMD Female Pin Header 2.54mm Pitch, 2x20; System: Connector; Value: Female Pin Header 2x20 SMD
TP7-TP10 = Test Point: Test Point Footprint; Value: Test Point

## Nets that join several sheets
+3V3: [02] - MCU (39 pins), [04] - USB INTERFACE (Q1.3 R28.1 R29.1), [05] - MicroSD (7 pins), [10] - ESP32 (7 pins), [11] - LAN (30 pins), [14] - BOT BOARD HEADER (CN27.21 CN27.22 TP7.1)
+5V0: [04] - USB INTERFACE (U6.5 U7.5), [14] - BOT BOARD HEADER (CN27.11 CN27.12 CN27.13 TP8.1)
+12V0: [12] - RELAYS (6 pins), [14] - BOT BOARD HEADER (5 pins)
GND: [02] - MCU (68 pins), [04] - USB INTERFACE (12 pins), [05] - MicroSD (5 pins), [10] - ESP32 (18 pins), [11] - LAN (25 pins), [12] - RELAYS (5 pins), [14] - BOT BOARD HEADER (39 pins)
+12V_CMD_BOT: [12] - RELAYS (K2.3 K3.4 K3.7), [14] - BOT BOARD HEADER (CN27.36)
ALERT0_TMP275_BOT: [02] - MCU (U3.B2), [14] - BOT BOARD HEADER (CN28.40)
ALERT1_TMP275_BOT: [02] - MCU (U3.A2), [14] - BOT BOARD HEADER (CN28.39)
ALERT2_TMP275_BOT: [02] - MCU (U3.A1), [14] - BOT BOARD HEADER (CN28.2)
ALERT3_TMP275_BOT: [02] - MCU (U3.B1), [14] - BOT BOARD HEADER (CN28.1)
ALERT4_TMP275_BOT: [02] - MCU (U3.B3), [14] - BOT BOARD HEADER (CN28.5)
ALERT5_TMP275_BOT: [02] - MCU (U3.C2), [14] - BOT BOARD HEADER (CN28.4)
ALERT6_TMP275_BOT: [02] - MCU (U3.C4), [14] - BOT BOARD HEADER (CN28.36)
ALERT7_TMP275_BOT: [02] - MCU (U3.C3), [14] - BOT BOARD HEADER (CN28.37)
BTN-1_BOT: [02] - MCU (U3.A10), [14] - BOT BOARD HEADER (CN28.20)
BTN-2_BOT: [02] - MCU (U3.A9), [14] - BOT BOARD HEADER (CN28.19)
BTN-3_BOT: [02] - MCU (U3.B8), [14] - BOT BOARD HEADER (CN28.18)
BTN-4_BOT: [02] - MCU (U3.B7), [14] - BOT BOARD HEADER (CN28.17)
BTN-5_BOT: [02] - MCU (U3.B6), [14] - BOT BOARD HEADER (CN28.16)
DISP_A0_BOT: [02] - MCU (U3.A3), [14] - BOT BOARD HEADER (CN28.8)
DISP_CS_BOT: [02] - MCU (U3.B5), [14] - BOT BOARD HEADER (CN28.11)
DISP_LEDA_BOT: [02] - MCU (U3.B4), [14] - BOT BOARD HEADER (CN28.7)
DISP_RST_BOT: [02] - MCU (U3.A4), [14] - BOT BOARD HEADER (CN28.10)
DISP_SCLK_BOT: [02] - MCU (U3.A6), [14] - BOT BOARD HEADER (CN28.14)
DISP_SID_BOT: [02] - MCU (U3.A5), [14] - BOT BOARD HEADER (CN28.13)
ESP32_EN: [02] - MCU (U3.D10), [10] - ESP32 (R58.2 U13.3)
ESP32_RXD0: [02] - MCU (TP5.1 U3.C11), [10] - ESP32 (CN23.3 U13.34)
ESP32_TXD0: [02] - MCU (TP6.1 U3.B11), [10] - ESP32 (CN23.18 U13.35)
ETH_CRS_DV: [02] - MCU (U3.R3), [11] - LAN (R73.2 U14.40)
ETH_MDC: [02] - MCU (U3.M3), [11] - LAN (U14.31)
ETH_MDIO: [02] - MCU (U3.P2), [11] - LAN (R64.1 U14.30)
ETH_RESET: [02] - MCU (U3.N3), [11] - LAN (R78.2 U14.29)
ETH_RXD0: [02] - MCU (U3.N5), [11] - LAN (R70.1)
ETH_RXD1: [02] - MCU (U3.P5), [11] - LAN (R71.1)
ETH_TX_EN: [02] - MCU (U3.B9), [11] - LAN (R65.1)
ETH_TXD0: [02] - MCU (U3.A8), [11] - LAN (R66.1)
ETH_TXD1: [02] - MCU (U3.A7), [11] - LAN (R67.1)
I2C3_SCL: [02] - MCU (R8.2 TP3.1 U3.N12), [14] - BOT BOARD HEADER (CN27.18)
I2C3_SDA: [02] - MCU (R9.2 TP4.1 U3.M12), [14] - BOT BOARD HEADER (CN27.16)
INT_VCNL4200_BOT: [02] - MCU (U3.P11), [14] - BOT BOARD HEADER (CN27.23)
INT_VEML6030_BOT: [02] - MCU (U3.H15), [14] - BOT BOARD HEADER (CN28.21)
MCO: [02] - MCU (U3.F15), [11] - LAN (R85.1)
RESET_MB_BOT: [02] - MCU (U3.R11), [14] - BOT BOARD HEADER (CN27.26)
RMII_REF_CLK: [02] - MCU (U3.N2), [11] - LAN (R84.2 R85.2 U14.34)
TEC_A_BOT: [12] - RELAYS (K3.3), [14] - BOT BOARD HEADER (CN27.30 CN27.31 CN27.32)
TEC_B_BOT: [12] - RELAYS (K3.6), [14] - BOT BOARD HEADER (CN27.33 CN27.34 CN27.35)
TEC_CUR_DIR: [02] - MCU (U3.P6), [12] - RELAYS (R87.1)
TEC_ON/OFF: [02] - MCU (U3.N6), [12] - RELAYS (R86.1)
USART1_RX_BOT: [02] - MCU (TP2.1 U3.R13), [14] - BOT BOARD HEADER (CN27.27)
USART1_TX_BOT: [02] - MCU (TP1.1 U3.R12), [14] - BOT BOARD HEADER (CN27.29)
USB_OVRCUR: [02] - MCU (U3.R10), [04] - USB INTERFACE (R28.2 U6.3)
USB_PWR_EN: [02] - MCU (U3.P10), [04] - USB INTERFACE (R29.2 U6.4)
USBFS_D_N: [02] - MCU (U3.C15), [04] - USB INTERFACE (R26.1)
USBFS_D_P: [02] - MCU (U3.B15), [04] - USB INTERFACE (R27.1)
USBFS_VBUS: [02] - MCU (U3.E15), [04] - USB INTERFACE (R23.1 R24.2)
USBHS_D_N: [02] - MCU (U3.R14), [04] - USB INTERFACE (R30.1)
USBHS_D_P: [02] - MCU (U3.R15), [04] - USB INTERFACE (R31.1)
uSD_CLK: [02] - MCU (U3.A12), [05] - MicroSD (CN8.5)
uSD_CMD: [02] - MCU (U3.D12), [05] - MicroSD (CN8.3 R34.1)
uSD_D0: [02] - MCU (U3.G14), [05] - MicroSD (CN8.7 R33.1)
uSD_D1: [02] - MCU (U3.F14), [05] - MicroSD (CN8.8 R32.1)
uSD_D2: [02] - MCU (U3.B14), [05] - MicroSD (CN8.1 R36.1)
uSD_D3: [02] - MCU (U3.B13), [05] - MicroSD (CN8.2 R35.1)
uSD_DETECT: [02] - MCU (U3.C12), [05] - MicroSD (CN8.9 R37.2)